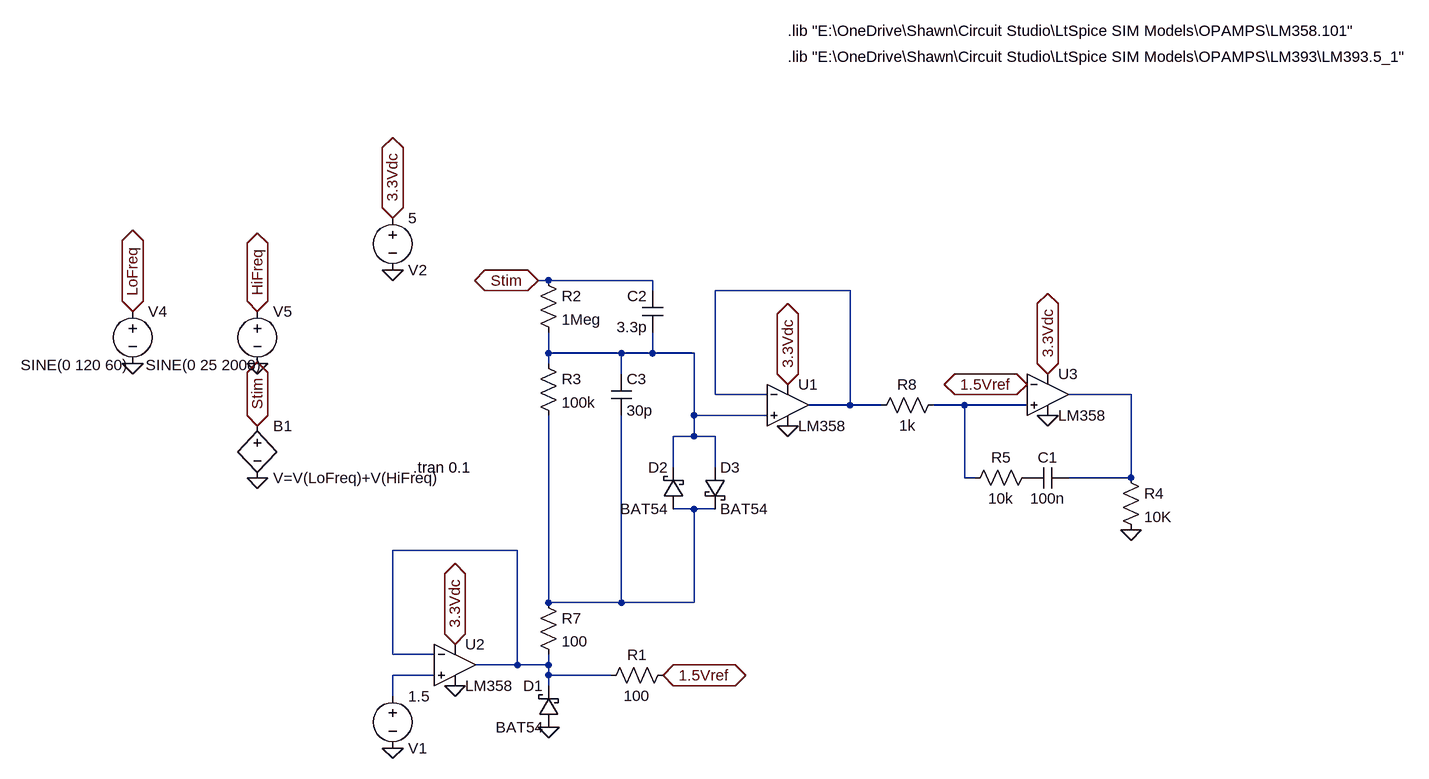
[diagram p0: schematic Zero-Cross Detect - Shawn Melanson.asc]
Zero-Cross Detect - Shawn Melanson.asc, the LTspice schematic file:
Version 4
SHEET 1 1572 756
WIRE -64 16 -80 16
WIRE 96 16 -64 16
WIRE 96 32 96 16
WIRE 400 32 192 32
WIRE -64 128 -64 96
WIRE 48 128 -64 128
WIRE 96 128 96 96
WIRE 96 128 48 128
WIRE 160 128 96 128
WIRE -64 144 -64 128
WIRE 48 160 48 128
WIRE 192 192 192 32
WIRE 272 192 192 192
WIRE 832 192 736 192
WIRE 400 208 400 32
WIRE 400 208 336 208
WIRE 448 208 400 208
WIRE 576 208 528 208
WIRE 672 208 576 208
WIRE 160 224 160 128
WIRE 272 224 160 224
WIRE 160 256 160 224
WIRE 160 256 128 256
WIRE 192 256 160 256
WIRE 128 304 128 256
WIRE 192 304 192 256
WIRE 576 320 576 208
WIRE 592 320 576 320
WIRE 832 320 832 192
WIRE 832 320 736 320
WIRE 160 368 128 368
WIRE 192 368 160 368
WIRE -112 432 -304 432
WIRE -64 512 -64 224
WIRE 48 512 48 224
WIRE 48 512 -64 512
WIRE 160 512 160 368
WIRE 160 512 48 512
WIRE -304 592 -304 432
WIRE -240 592 -304 592
WIRE -112 608 -112 432
WIRE -112 608 -176 608
WIRE -64 608 -64 592
WIRE -64 608 -112 608
WIRE -240 624 -304 624
WIRE -64 624 -64 608
WIRE 32 624 -64 624
WIRE -64 640 -64 624
WIRE -304 656 -304 624
FLAG -304 -80 3.3Vdc
IOPIN -304 -80 BiDir
FLAG -304 0 0
FLAG -208 576 3.3Vdc
IOPIN -208 576 BiDir
FLAG -208 640 0
FLAG -304 736 0
FLAG 704 160 3.3Vdc
IOPIN 704 160 BiDir
FLAG 704 224 0
FLAG -64 704 0
FLAG 304 176 3.3Vdc
IOPIN 304 176 BiDir
FLAG 304 240 0
FLAG 112 624 1.5Vref
IOPIN 112 624 BiDir
FLAG 672 176 1.5Vref
IOPIN 672 176 BiDir
FLAG -704 144 0
FLAG -512 144 0
FLAG -704 64 LoFreq
IOPIN -704 64 BiDir
FLAG -512 64 HiFreq
IOPIN -512 64 BiDir
FLAG -512 320 0
FLAG -512 240 Stim
IOPIN -512 240 BiDir
FLAG -80 16 Stim
IOPIN -80 16 BiDir
FLAG 832 400 0
SYMBOL voltage -304 -96 R0
WINDOW 0 24 96 Left 2
WINDOW 3 24 16 Left 2
WINDOW 123 0 0 Left 2
WINDOW 39 0 0 Left 2
SYMATTR InstName V2
SYMATTR Value 5
SYMBOL res -80 0 R0
SYMATTR InstName R2
SYMATTR Value 1Meg
SYMBOL res -80 128 R0
SYMATTR InstName R3
SYMATTR Value 100k
SYMBOL Opamps\\opamp2 -208 544 R0
SYMATTR InstName U2
SYMATTR Value LM358
SYMBOL voltage -304 640 R0
WINDOW 0 24 96 Left 2
WINDOW 3 24 16 Left 2
WINDOW 123 0 0 Left 2
WINDOW 39 0 0 Left 2
SYMATTR InstName V1
SYMATTR Value 1.5
SYMBOL Opamps\\opamp2 704 128 R0
SYMATTR InstName U3
SYMATTR Value LM358
SYMBOL schottky -48 704 R180
WINDOW 0 24 64 Left 2
WINDOW 3 24 0 Left 2
SYMATTR InstName D1
SYMATTR Value BAT54
SYMATTR Description Diode
SYMATTR Type diode
SYMBOL schottky 144 368 R180
WINDOW 0 24 64 Left 2
WINDOW 3 24 0 Left 2
SYMATTR InstName D2
SYMATTR Value BAT54
SYMATTR Description Diode
SYMATTR Type diode
SYMBOL schottky 176 304 R0
SYMATTR InstName D3
SYMATTR Value BAT54
SYMATTR Description Diode
SYMATTR Type diode
SYMBOL Opamps\\opamp2 304 144 R0
SYMATTR InstName U1
SYMATTR Value LM358
SYMBOL res -80 496 R0
SYMATTR InstName R7
SYMATTR Value 100
SYMBOL res 128 608 R90
WINDOW 0 0 56 VBottom 2
WINDOW 3 32 56 VTop 2
SYMATTR InstName R1
SYMATTR Value 100
SYMBOL res 544 192 R90
WINDOW 0 0 56 VBottom 2
WINDOW 3 32 56 VTop 2
SYMATTR InstName R8
SYMATTR Value 1k
SYMBOL cap 112 96 R180
WINDOW 0 24 56 Left 2
WINDOW 3 24 8 Left 2
SYMATTR InstName C2
SYMATTR Value 3.3p
SYMBOL cap 32 160 R0
SYMATTR InstName C3
SYMATTR Value 30p
SYMBOL voltage -704 48 R0
WINDOW 3 -172 98 Left 2
WINDOW 123 0 0 Left 2
WINDOW 39 0 0 Left 2
SYMATTR Value SINE(0 120 60)
SYMATTR InstName V4
SYMBOL voltage -512 48 R0
WINDOW 3 -172 98 Left 2
WINDOW 123 0 0 Left 2
WINDOW 39 0 0 Left 2
SYMATTR Value SINE(0 25 2000)
SYMATTR InstName V5
SYMBOL bv -512 224 R0
SYMATTR InstName B1
SYMATTR Value V=V(LoFreq)+V(HiFreq)
SYMBOL cap 736 304 R90
WINDOW 0 0 32 VBottom 2
WINDOW 3 32 32 VTop 2
SYMATTR InstName C1
SYMATTR Value 100n
SYMBOL res 816 304 R0
SYMATTR InstName R4
SYMATTR Value 10K
SYMBOL res 688 304 R90
WINDOW 0 0 56 VBottom 2
WINDOW 3 32 56 VTop 2
SYMATTR InstName R5
SYMATTR Value 10k
TEXT 304 -328 Left 2 !.lib "E:\\OneDrive\\Shawn\\Circuit Studio\\LtSpice SIM Models\\OPAMPS\\LM393\\LM393.5_1"
TEXT -272 304 Left 2 !.tran 0.1
TEXT 304 -368 Left 2 !.lib "E:\\OneDrive\\Shawn\\Circuit Studio\\LtSpice SIM Models\\OPAMPS\\LM358.101"

The netlist it stands for:
* Zero-Cross Detect - Shawn Melanson.asc
V2 3.3Vdc 0 5
R2 Stim N002 1Meg
R3 N002 N005 100k
XU2 N007 N006 3.3Vdc 0 N006 LM358  ; pins In+ In- V+ V- OUT
V1 N007 0 1.5
XU3 N004 1.5Vref 3.3Vdc 0 N003 LM358  ; pins In+ In- V+ V- OUT
D1 0 N006 BAT54
D2 N005 N002 BAT54
D3 N002 N005 BAT54
XU1 N002 N001 3.3Vdc 0 N001 LM358  ; pins In+ In- V+ V- OUT
R7 N005 N006 100
R1 1.5Vref N006 100
R8 N004 N001 1k
C2 N002 Stim 3.3p
C3 N002 N005 30p
V4 LoFreq 0 SINE(0 120 60)
V5 HiFreq 0 SINE(0 25 2000)
B1 Stim 0 V=V(LoFreq)+V(HiFreq)
C1 N003 P001 100n
R4 N003 0 10K
R5 P001 N004 10k
.model D D
.lib standard.dio
.lib "E:\OneDrive\Shawn\Circuit Studio\LtSpice SIM Models\OPAMPS\LM393\LM393.5_1"
.tran 0.1
.lib "E:\OneDrive\Shawn\Circuit Studio\LtSpice SIM Models\OPAMPS\LM358.101"
.backanno
.end